# EAGLE schematic Buck (EAGLE 9.6.2)
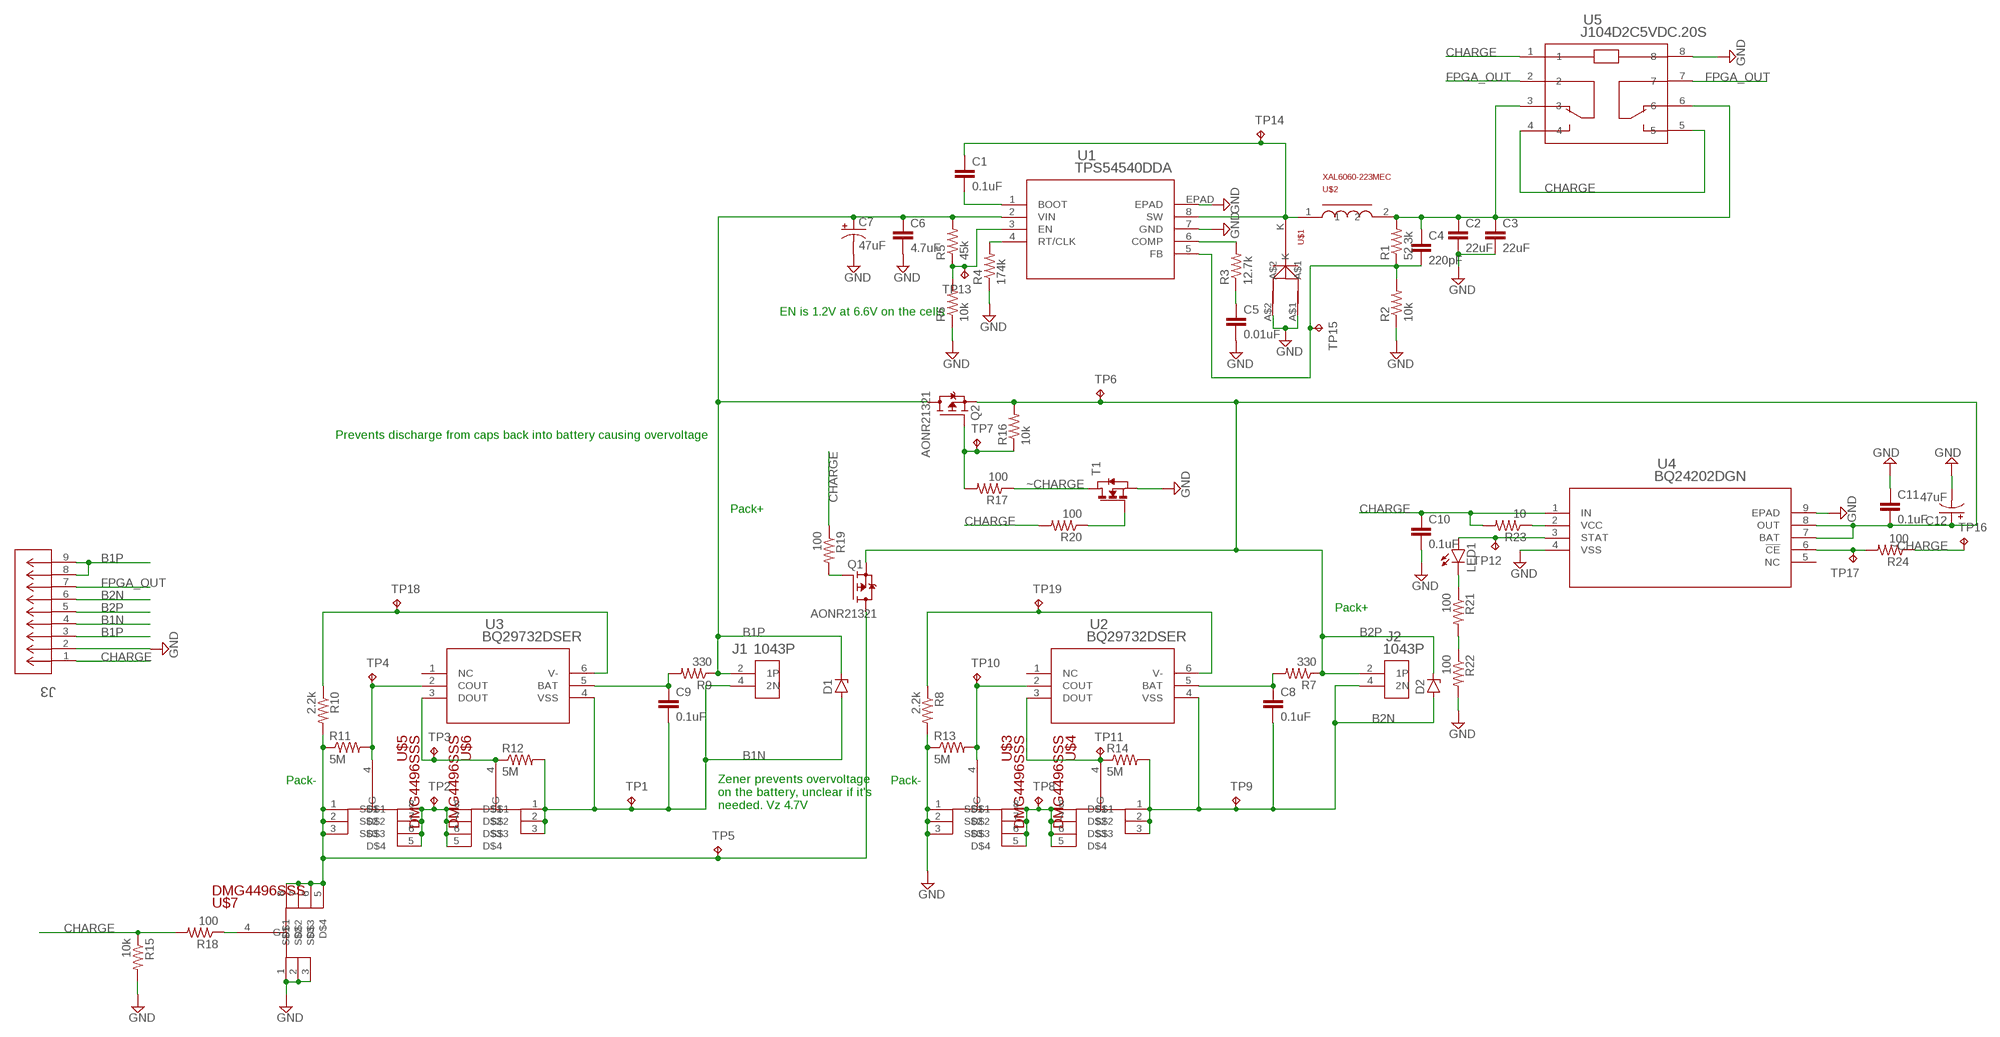
[diagram p0: schematic, sheet 1]

## Parts
C1  0.1uF  C-EUC0603  [C0603]
C2  22uF  C-EUC0603  [C0603]
C3  22uF  C-EUC0603  [C0603]
C4  220pF  C-EUC0603  [C0603]
C5  0.01uF  C-EUC0603  [C0603]
C6  4.7uF  C-EUC0603  [C0603]
C7  47uF  CPOL-USE2-5  [E2-5]
C8  0.1uF  C-EUC0603  [C0603]
C9  0.1uF  C-EUC0603  [C0603]
C10  0.1uF  C-EUC0603  [C0603]
C11  0.1uF  C-EUC0603  [C0603]
C12  47uF  CPOL-USE2-5  [E2-5]
D1  ZENER-DIODESOT23  [SOT23]
D2  ZENER-DIODESOT23  [SOT23]
J1  1043P  [CONN2_1043P_KEY]
J2  1043P  [CONN2_1043P_KEY]
J3  L77TSEH09SOL2  [CONN_L77TSEH09SOL2_AMP]
LED1  LEDCHIPLED_0603  [CHIPLED_0603]
Q1  AONR21321  [TRANS_AONR21321]
Q2  AONR21321  [TRANS_AONR21321]
R1  52.3k  R-US_R0603  [R0603]
R2  10k  R-US_R0603  [R0603]
R3  12.7k  R-US_R0603  [R0603]
R4  174k  R-US_R0603  [R0603]
R5  45k  R-US_R0603  [R0603]
R6  10k  R-US_R0603  [R0603]
R7  330  R-US_R0603  [R0603]
R8  2.2k  R-US_R0603  [R0603]
R9  330  R-US_R0603  [R0603]
R10  2.2k  R-US_R0603  [R0603]
R11  5M  R-US_R0603  [R0603]
R12  5M  R-US_R0603  [R0603]
R13  5M  R-US_R0603  [R0603]
R14  5M  R-US_R0603  [R0603]
R15  10k  R-US_R0603  [R0603]
R16  10k  R-US_R0603  [R0603]
R17  100  R-US_R0603  [R0603]
R18  100  R-US_R0603  [R0603]
R19  100  R-US_R0603  [R0603]
R20  100  R-US_R0603  [R0603]
R21  100  R-US_R0603  [R0603]
R22  100  R-US_R0603  [R0603]
R23  10  R-US_R0603  [R0603]
R24  100  R-US_R0603  [R0603]
T1  NMOSSOT23  [SOT-23]
TP1  TPTP13R  [TP13R]
TP2  TPTP13R  [TP13R]
TP3  TPTP13R  [TP13R]
TP4  TPTP13R  [TP13R]
TP5  TPTP13R  [TP13R]
TP6  TPTP13R  [TP13R]
TP7  TPTP13R  [TP13R]
TP8  TPTP13R  [TP13R]
TP9  TPTP13R  [TP13R]
TP10  TPTP13R  [TP13R]
TP11  TPTP13R  [TP13R]
TP12  TPTP13R  [TP13R]
TP13  TPTP13R  [TP13R]
TP14  TPTP13R  [TP13R]
TP15  TPTP13R  [TP13R]
TP16  TPTP13R  [TP13R]
TP17  TPTP13R  [TP13R]
TP18  TPTP13R  [TP13R]
TP19  TPTP13R  [TP13R]
U1  TPS54540DDA  [DDA8_3P1X2P4_TEX]
U2  BQ29732DSER  [DSE6_TEX]
U3  BQ29732DSER  [DSE6_TEX]
U4  BQ24202DGN  [DGN8_1P57X1P89]
U5  J104D2C5VDC.20S  [RELAY8_J104D2C5VDC.20S_CRS]
U$1  SS3P5LHM3_A/H  [TO-227A]
U$2  XAL6060-223MEC  [XAL6060]
U$3  DMG4496SSS  [SO-8]
U$4  DMG4496SSS  [SO-8]
U$5  DMG4496SSS  [SO-8]
U$6  DMG4496SSS  [SO-8]
U$7  DMG4496SSS  [SO-8]

## Nets
B1N: C9.2 D1.1(A) J1.4(2N) J3.4 R12.2 TP1.TP U3.4(VSS) U$6.1(S$1) U$6.2(S$2) U$6.3(S$3)
B1P: C6.1 C7.+ D1.3(C) J1.2(1P) J3.3 J3.8 J3.9 Q2.5(D) Q2.6(D) Q2.7(D) Q2.8(D) Q2.9(D) Q2.9_1(D) Q2.9_2(D) R5.2 R9.1 U1.2(VIN)
B2N: C8.2 D2.1(A) J2.4(2N) J3.6 R14.2 TP9.TP U2.4(VSS) U$4.1(S$1) U$4.2(S$2) U$4.3(S$3)
B2P: C11.2 C12.+ D2.3(C) J2.2(1P) J3.5 Q1.1(S) Q1.2(S) Q1.3(S) Q2.1(S) Q2.2(S) Q2.3(S) R7.1 R16.2 TP6.TP U4.7(BAT) U4.8(OUT)
CHARGE: C10.1 J3.1 R15.1 R18.2 R19.1 R20.2 R23.2 U4.1(IN) U5.1 U5.4 U5.5
FPGA_OUT: J3.7 U5.2 U5.7
GND: C2.2 C3.2 C5.2 C6.2 C7.- C10.2 C11.1 C12.- J3.2 R2.1 R4.1 R6.1 R8.2 R13.1 R15.2 R22.2 T1.2(S) U1.7(GND) U1.EPAD U4.4(VSS) U4.9(EPAD) U5.8 U$1.A$1 U$1.A$2 U$3.1(S$1) U$3.2(S$2) U$3.3(S$3) U$7.1(S$1) U$7.2(S$2) U$7.3(S$3)
N$1: C1.2 U1.1(BOOT)
N$2: C1.1 TP14.TP U1.8(SW) U$1.K U$2.1
N$3: C2.1 C3.1 C4.1 R1.2 U5.3 U5.6 U$2.2
N$4: C5.1 R3.1
N$5: C4.2 R1.1 R2.2 TP15.TP U1.5(FB)
N$6: R3.2 U1.6(COMP)
N$7: Q2.4(G) R16.1 R17.2 TP7.TP
N$8: R4.2 U1.4(RT/CLK)
N$9: R5.1 R6.2 TP13.TP U1.3(EN)
N$10: TP8.TP U$3.5(D$4) U$3.6(D$3) U$3.7(D$2) U$3.8(D$1) U$4.5(D$4) U$4.6(D$3) U$4.7(D$2) U$4.8(D$1)
N$11: R13.2 TP10.TP U2.2(COUT) U$3.4(G)
N$12: R14.1 TP11.TP U2.3(DOUT) U$4.4(G)
N$14: C8.1 R7.2 U2.5(BAT)
N$15: TP2.TP U$5.5(D$4) U$5.6(D$3) U$5.7(D$2) U$5.8(D$1) U$6.5(D$4) U$6.6(D$3) U$6.7(D$2) U$6.8(D$1)
N$17: R8.1 TP19.TP U2.6(V-)
N$18: R11.2 TP4.TP U3.2(COUT) U$5.4(G)
N$19: R24.2 TP17.TP U4.6(!CE)
N$20: R12.1 TP3.TP U3.3(DOUT) U$6.4(G)
N$22: C9.1 R9.2 U3.5(BAT)
N$24: R10.1 TP18.TP U3.6(V-)
N$25: R18.1 U$7.4(G)
N$26: Q1.4(G) R19.2
N$27: Q1.5(D) Q1.6(D) Q1.7(D) Q1.8(D) Q1.9(D) Q1.9_1(D) Q1.9_2(D) R10.2 R11.1 TP5.TP U$5.1(S$1) U$5.2(S$2) U$5.3(S$3) U$7.5(D$4) U$7.6(D$3) U$7.7(D$2) U$7.8(D$1)
N$28: R20.1 T1.3(G)
N$29: LED1.C R21.1
N$30: R21.2 R22.1
N$31: LED1.A TP12.TP U4.3(STAT)
N$33: R23.1 U4.2(VCC)
~CHARGE: R17.1 R24.1 T1.1(D) TP16.TP
Unconnected: U2.1(NC) U3.1(NC) U4.5(NC)

## Notes on the sheet
- EN is 1.2V at 6.6V on the cells
- Prevents discharge from caps back into battery causing overvoltage
- Pack+
- Pack+
- Pack- | Pack-
- Zener prevents overvoltage 
  on the battery, unclear if it's
  needed. Vz 4.7V

## Library data of the parts
C1-C6 C8-C11 = rcl:C-EU: CAPACITOR, European symbol; SPICEPREFIX: C
C7 C12 = rcl:CPOL-US: POLARIZED CAPACITOR, American symbol; SPICEPREFIX: C
D1 D2 = diode:ZENER-DIODE: Z-Diode
J1 J2 = BIGCRETE:1043P; COPYRIGHT: Copyright (C) 2022 Ultra Librarian. All rights reserved.; DIGI-KEY_PART_NUMBER_1: 36-1043P-ND; MANUFACTURER_PART_NUMBER: 1043P; MFR_NAME: Keystone Electronics
J3 = BIGCRETE:L77TSEH09SOL2; COPYRIGHT: Copyright (C) 2022 Ultra Librarian. All rights reserved.; DIGI-KEY_PART_NUMBER_1: L77TSEH09SOL2-ND; MANUFACTURER_PART_NUMBER: L77TSEH09SOL2; MFR_NAME: Amphenol ICC
LED1 = led:LED: LED OSRAM: - CHIPLED LG R971, LG N971, LY N971, LG Q971, LY Q971, LO R971, LY R971 LH N974, LH R974 LS Q976, LO Q976, LY Q976 LO Q996 - Hyper CHIPLED LW Q18S LB Q993, LB Q99A, LB R99A - SideLED LS A670, LO A670, LY A670, LG A670, LP A670 LB A673, LV A673, LT A673, LW A673 LH A674 LY A675 LS A676, LA A676, LO A676, LY A676, LW A676 LS A679, LY A679, LG A679 - Hyper Micro SIDELED® LS Y876, LA Y876, LO Y876, LY Y876 LT Y87S - SmartLED LW L88C, LW L88S LB L89C, LB L89S, LG L890 LS L89K, LO L89K, LY L89K LS L896, LA L896, LO L896, LY L896 - TOPLED LS T670, LO T670, LY T670, LG T670, LP T670 LSG T670, LSP T670, LSY T670, LOP T670, LYG T670 LG T671, LOG T671, LSG T671 LB T673, LV T673, LT T673, LW T673 LH T674 LS T676, LA T676, LO T676, LY T676, LB T676, LH T676, LSB T676, LW T676 LB T67C, LV T67C, LT T67C, LS T67K, LO T67K, LY T67K, LW E67C LS E67B, LA E67B, LO E67B, LY E67B, LB E67C, LV E67C, LT E67C LW T67C LS T679, LY T679, LG T679 LS T770, LO T770, LY T770, LG T770, LP T770 LB T773, LV T773, LT T773, LW T773 LH T774 LS E675, LA E675, LY E675, LS T675 LS T776, LA T776, LO T776, LY T776, LB T776 LHGB T686 LT T68C, LB T68C - Hyper Mini TOPLED® LB M676 - Mini TOPLED Santana® LG M470 LS M47K, LO M47K, LY M47K Source: http://www.osram.convergy.de LUXEON: - LUMILED® LXK2-PW12-R00, LXK2-PW12-S00, LXK2-PW14-U00, LXK2-PW14-V00 LXK2-PM12-R00, LXK2-PM12-S00, LXK2-PM14-U00 LXK2-PE12-Q00, LXK2-PE12-R00, LXK2-PE12-S00, LXK2-PE14-T00, LXK2-PE14-U00 LXK2-PB12-K00, LXK2-PB12-L00, LXK2-PB12-M00, LXK2-PB14-N00, LXK2-PB14-P00, LXK2-PB14-Q00 LXK2-PR12-L00, LXK2-PR12-M00, LXK2-PR14-Q00, LXK2-PR14-R00 LXK2-PD12-Q00, LXK2-PD12-R00, LXK2-PD12-S00 LXK2-PH12-R00, LXK2-PH12-S00 LXK2-PL12-P00, LXK2-PL12-Q00, LXK2-PL12-R00 Source: www.luxeon.com KINGBRIGHT: KA-3528ASYC Source: www.kingbright.com
Q1 Q2 = AONR21321:AONR21321: MOSFET P-CH 30V 3X3 DFN EP; DESCRIPTION: P-Channel 30 V 24A (Tc) 4.1W (Ta), 24W (Tc) Surface Mount 8-DFN-EP (3x3); DIGI-KEY_PART_NUMBER: 785-1797-2-ND; MF: Alpha &; MP: AONR21321; PACKAGE: PowerVDFN-8 Alpha &amp; Omega Semiconductor Inc.
R1-R24 = rcl:R-US_: RESISTOR, American symbol; SPICEPREFIX: R
T1 = zetex:NMOSSOT23: MOS FET; OC_FARNELL: unknown; OC_NEWARK: unknown
TP1-TP19 = testpad:TP: Test pad
U1 = BIGCRETE:TPS54540DDA; COPYRIGHT: Copyright (C) 2022 Ultra Librarian. All rights reserved.; MANUFACTURER_PART_NUMBER: TPS54540DDA; MFR_NAME: Texas Instruments
U2 U3 = BIGCRETE:BQ29732DSER; COPYRIGHT: Copyright (C) 2022 Ultra Librarian. All rights reserved.; MANUFACTURER_PART_NUMBER: BQ29732DSER; MFR_NAME: Texas Instruments
U4 = BIGCRETE:BQ24202DGN; COPYRIGHT: Copyright (C) 2022 Ultra Librarian. All rights reserved.; DIGI-KEY_PART_NUMBER_1: 296-12411-5-ND; DIGI-KEY_PART_NUMBER_2: 2156-BQ24202DGN-ND; MANUFACTURER_PART_NUMBER: BQ24202DGN; MFR_NAME: Texas Instruments
U5 = BIGCRETE:J104D2C5VDC.20S; COPYRIGHT: Copyright (C) 2022 Ultra Librarian. All rights reserved.; DIGI-KEY_PART_NUMBER_1: 2449-J104D2C5VDC.20S-ND; MANUFACTURER_PART_NUMBER: J104D2C5VDC.20S; MFR_NAME: CIT Relay & Switch
U$1 = BIGCRETE:SS3P5LHM3_A/H
U$2 = BIGCRETE:XAL6060-223MEC
U$3-U$7 = BIGCRETE:DMG4496SSS